# Altium schematic sheet Sheet1.SchDoc
size A; SheetNumber: 1; SheetTotal: 6
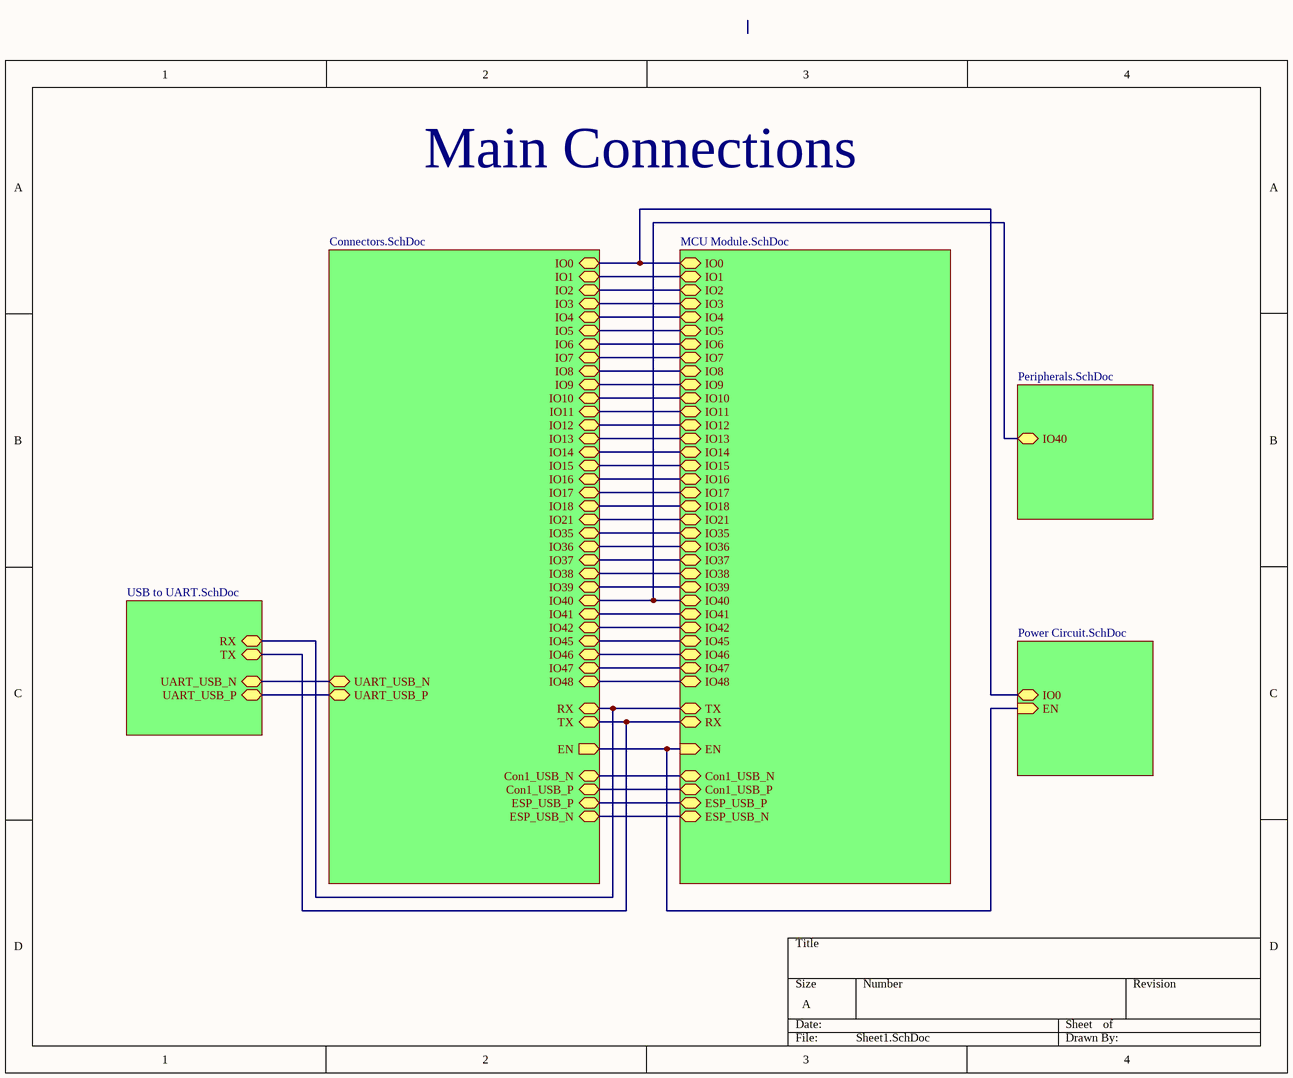
[diagram p0: Sheet1.SchDoc]

## Sub-sheets
Designator = MCU Module.SchDoc: IO0 (bidir), IO1 (bidir), IO2 (bidir), IO3 (bidir), IO4 (bidir), IO5 (bidir), IO6 (bidir), IO7 (bidir), IO8 (bidir), IO9 (bidir), IO10 (bidir), IO11 (bidir), IO12 (bidir), IO13 (bidir), IO14 (bidir), IO15 (bidir), IO16 (bidir), IO17 (bidir), IO18 (bidir), Con1_USB_P (bidir), Con1_USB_N (bidir), IO21 (bidir), IO35 (bidir), IO36 (bidir), IO37 (bidir), IO38 (bidir), IO39 (bidir), IO40 (bidir), IO41 (bidir), IO42 (bidir), IO45 (bidir), IO46 (bidir), IO47 (bidir), IO48 (bidir), TX (bidir), RX (bidir), EN (in), ESP_USB_P (bidir), ESP_USB_N (bidir)
Designator = Peripherals.SchDoc: IO40 (bidir)
Designator = Power Circuit.SchDoc: IO0 (bidir), EN (in)
Designator = USB to UART.SchDoc: RX (bidir), TX (bidir), UART_USB_N (bidir), UART_USB_P (bidir)
Designator = Connectors.SchDoc: IO0 (bidir), IO1 (bidir), IO2 (bidir), IO3 (bidir), IO4 (bidir), IO5 (bidir), IO6 (bidir), IO7 (bidir), IO8 (bidir), IO9 (bidir), IO10 (bidir), IO11 (bidir), IO12 (bidir), IO13 (bidir), IO14 (bidir), IO15 (bidir), IO16 (bidir), IO17 (bidir), IO18 (bidir), IO21 (bidir), IO35 (bidir), IO36 (bidir), IO37 (bidir), IO38 (bidir), IO39 (bidir), IO40 (bidir), IO41 (bidir), IO42 (bidir), IO45 (bidir), IO46 (bidir), IO47 (bidir), IO48 (bidir), RX (bidir), TX (bidir), EN (out), Con1_USB_P (bidir), Con1_USB_N (bidir), ESP_USB_P (bidir), ESP_USB_N (bidir), UART_USB_N (bidir), UART_USB_P (bidir)

## Nets
(unnamed): sheet Designator/IO0, sheet Designator/IO0, sheet Designator/IO0
(unnamed): sheet Designator/IO1, sheet Designator/IO1
(unnamed): sheet Designator/IO2, sheet Designator/IO2
(unnamed): sheet Designator/IO3, sheet Designator/IO3
(unnamed): sheet Designator/IO4, sheet Designator/IO4
(unnamed): sheet Designator/IO5, sheet Designator/IO5
(unnamed): sheet Designator/IO6, sheet Designator/IO6
(unnamed): sheet Designator/IO7, sheet Designator/IO7
(unnamed): sheet Designator/IO8, sheet Designator/IO8
(unnamed): sheet Designator/IO9, sheet Designator/IO9
(unnamed): sheet Designator/IO10, sheet Designator/IO10
(unnamed): sheet Designator/IO11, sheet Designator/IO11
(unnamed): sheet Designator/IO12, sheet Designator/IO12
(unnamed): sheet Designator/IO13, sheet Designator/IO13
(unnamed): sheet Designator/IO14, sheet Designator/IO14
(unnamed): sheet Designator/IO15, sheet Designator/IO15
(unnamed): sheet Designator/IO16, sheet Designator/IO16
(unnamed): sheet Designator/IO17, sheet Designator/IO17
(unnamed): sheet Designator/IO18, sheet Designator/IO18
(unnamed): sheet Designator/Con1_USB_P, sheet Designator/Con1_USB_P
(unnamed): sheet Designator/Con1_USB_N, sheet Designator/Con1_USB_N
(unnamed): sheet Designator/IO21, sheet Designator/IO21
(unnamed): sheet Designator/IO35, sheet Designator/IO35
(unnamed): sheet Designator/IO36, sheet Designator/IO36
(unnamed): sheet Designator/IO37, sheet Designator/IO37
(unnamed): sheet Designator/IO38, sheet Designator/IO38
(unnamed): sheet Designator/IO39, sheet Designator/IO39
(unnamed): sheet Designator/IO40, sheet Designator/IO40, sheet Designator/IO40
(unnamed): sheet Designator/IO41, sheet Designator/IO41
(unnamed): sheet Designator/IO42, sheet Designator/IO42
(unnamed): sheet Designator/IO45, sheet Designator/IO45
(unnamed): sheet Designator/IO46, sheet Designator/IO46
(unnamed): sheet Designator/IO47, sheet Designator/IO47
(unnamed): sheet Designator/IO48, sheet Designator/IO48
(unnamed): sheet Designator/TX, sheet Designator/RX, sheet Designator/RX
(unnamed): sheet Designator/RX, sheet Designator/TX, sheet Designator/TX
(unnamed): sheet Designator/EN, sheet Designator/EN, sheet Designator/EN
(unnamed): sheet Designator/ESP_USB_P, sheet Designator/ESP_USB_P
(unnamed): sheet Designator/ESP_USB_N, sheet Designator/ESP_USB_N
(unnamed): sheet Designator/UART_USB_N, sheet Designator/UART_USB_N
(unnamed): sheet Designator/UART_USB_P, sheet Designator/UART_USB_P

## Notes on the sheet
- Main Connections